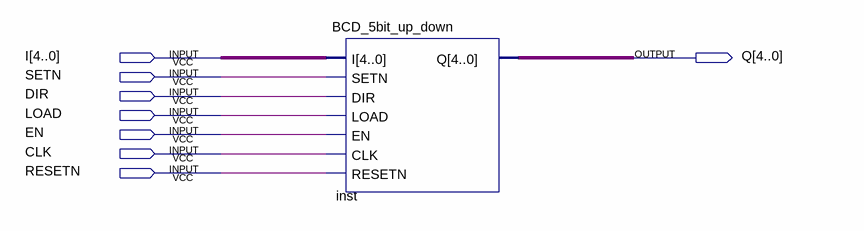
[diagram p0: schematic sheet]
// Quartus schematic TOP.bdf as structural Verilog: 1 symbols, 8 pins
module TOP (
  input  [4:0] I,
  input  SETN,
  input  DIR,
  input  LOAD,
  input  EN,
  input  CLK,
  input  RESETN,
  output [4:0] Q
);

  BCD_5bit_up_down inst (.I(I), .SETN(SETN), .DIR(DIR), .LOAD(LOAD), .EN(EN), .CLK(CLK), .RESETN(RESETN), .Q(Q));
endmodule
